# EAGLE schematic OLM-env-sensor (EAGLE 6.4)
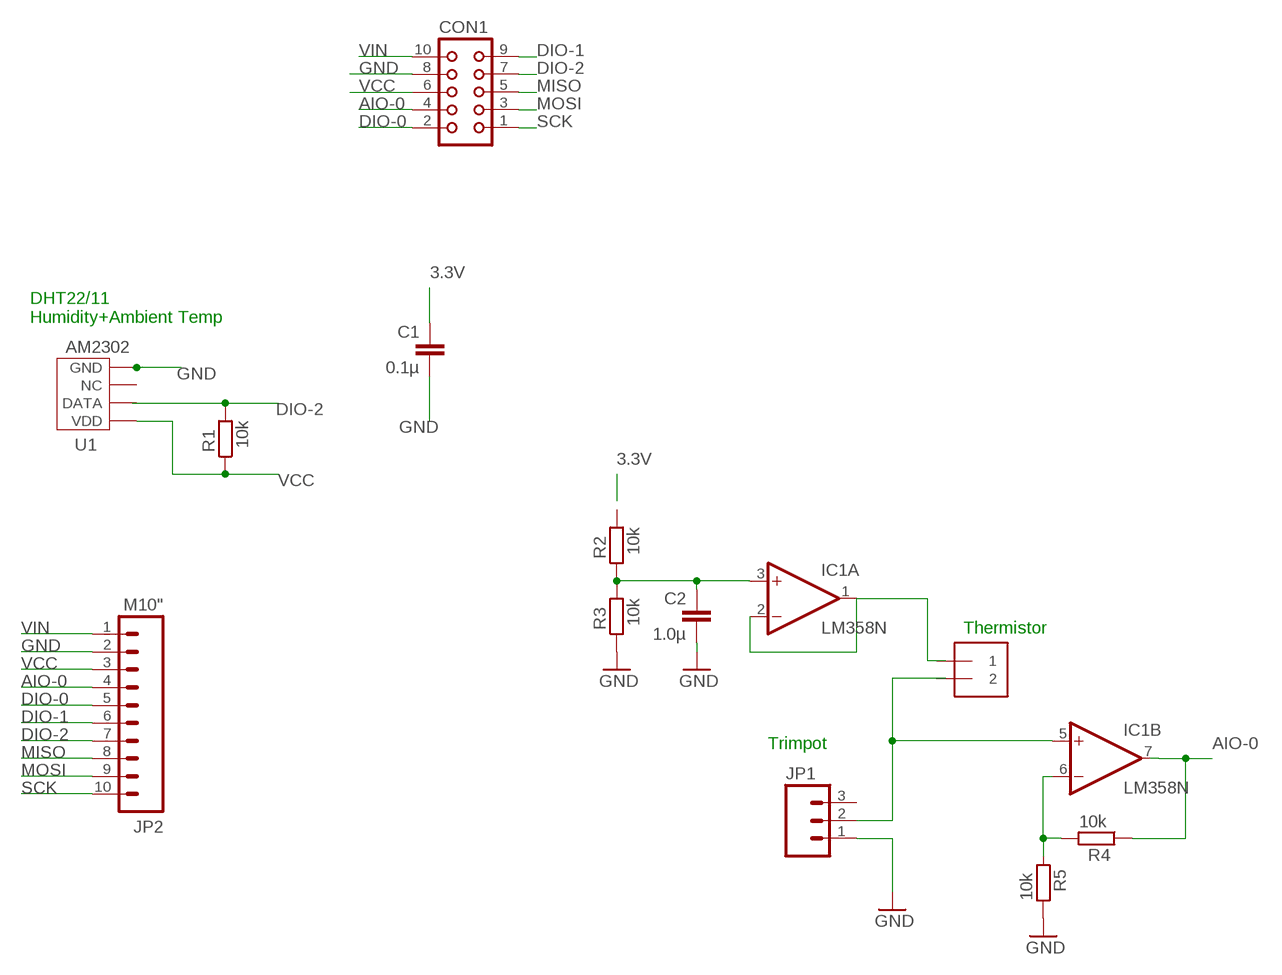
[diagram p0: schematic, sheet 1]

## Parts
C1  0.1µ  C-EU025-024X044  [C025-024X044]
C2  1.0µ  C-EU025-024X044  [C025-024X044]
CON1  CON10L  [CON10L]
IC1  LM358N  [DIL08]
J1  1X2-3.5MM  [1X2-3.5MM]
JP1  M03PTH  [1X03]
JP2  M10"  [1X10]
R1  10k  R-EU_0204/7  [0204/7]
R2  10k  R-EU_0204/7  [0204/7]
R3  10k  R-EU_0204/7  [0204/7]
R4  10k  R-EU_0204/7  [0204/7]
R5  10k  R-EU_0204/7  [0204/7]
U1  AM2302  [AM2302]

## Nets
3.3V: C1.1
AIO-0: CON1.4 IC1.5(B:+IN) IC1.7(B:OUT) J1.2 JP1.2 JP2.4 R4.1
DIO-0: CON1.2 JP2.5
DIO-1: CON1.9 JP2.6
DIO-2: CON1.7 JP2.7 R1.2 U1.P$2(DATA)
GND: C1.2 C2.2 CON1.8 JP1.1 JP2.2 R3.1 R5.2 U1.P$4(GND)
MISO: CON1.5 JP2.8
MOSI: CON1.3 JP2.9
N$1: IC1.1(A:OUT) IC1.2(A:-IN) J1.1
N$3: C2.1 IC1.3(A:+IN) R2.1 R3.2
N$6: IC1.6(B:-IN) R4.2
SCK: CON1.1 JP2.10
VCC: CON1.6 JP2.3 R1.1 U1.P$1(VDD)
VIN: CON1.10 JP2.1
Unconnected: JP1.3 R2.2 R5.1 U1.P$3(NC)

## Notes on the sheet
- DHT22/11
  Humidity+Ambient Temp
- Thermistor
- Trimpot

## Power pins joined to a net without a drawn wire
V+: IC1.8(P:V+)
V-: IC1.4(P:V-)

## Library data of the parts
C1 C2 = resistor:C-EU: CAPACITOR, European symbol
CON1 = con-harting:CON10L: CONNECTOR; OC_FARNELL: unknown; OC_NEWARK: unknown
IC1 = linear:LM358: OP AMP also LM158; LM258; LM2904 Source: http://cache.national.com/ds/LM/LM158.pdf
J1 = adafruit:1X2: 3.5mm Terminal block http://www.ladyada.net/library/pcb/eaglelibrary.html
JP1 = SparkFun-Connectors:M03: Header 3 Standard 3-pin 0.1" header. Use with straight break away headers (SKU : PRT-00116), right angle break away headers (PRT-00553), swiss pins (PRT-00743), machine pins (PRT-00117), and female headers (PRT-00115). Molex polarized connector foot print use with SKU : PRT-08232 with associated crimp pins and housings.
JP2 = SparkFun-Connectors:M10: Header 10 Standard 10-pin 0.1" header. Use with straight break away headers (SKU : PRT-00116), right angle break away headers (PRT-00553), swiss pins (PRT-00743), machine pins (PRT-00117), and female headers (PRT-00115).
R1-R5 = rcl:R-EU_: RESISTOR, European symbol
U1 = sensor:AM2302

## Net classes
0 default: width 0.254 mm, drill 0.254 mm, clearance 0.254 mm
1 power: width 0.813 mm, drill 0.254 mm, clearance 0.254 mm